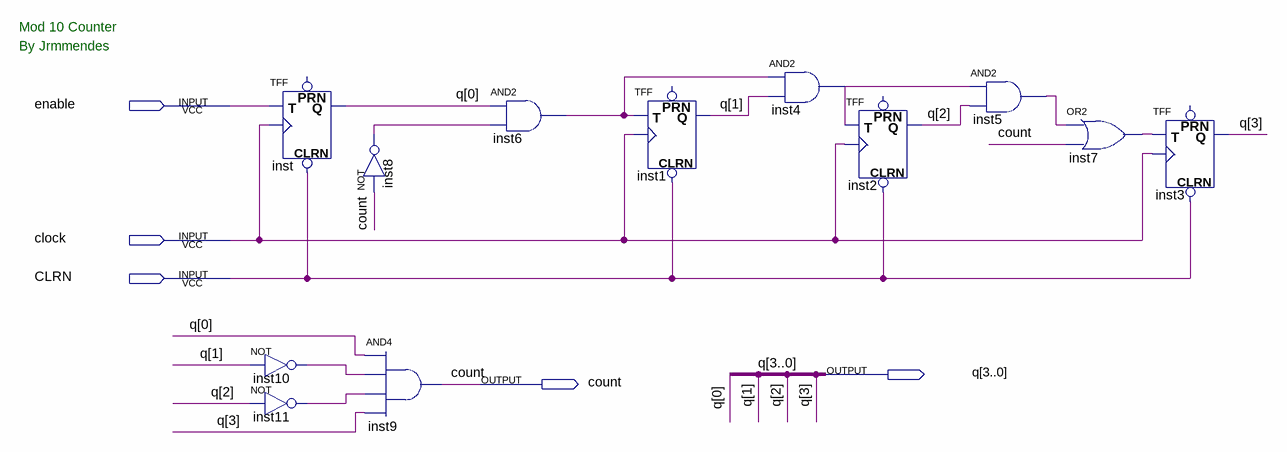
[diagram p0: schematic sheet]
// Quartus schematic mod_10_counter.bdf as structural Verilog: 12 symbols, 5 pins
module mod_10_counter (
  input  enable,
  input  clock,
  input  CLRN,
  output [3:0] q,
  output count
);

  wire inst4_out, inst5_out, inst6_out, inst7_out, inst8_out, inst10_out, inst11_out;

  TFF inst (.CLRN(CLRN), .T(enable), .CLK(clock), .Q(q[0]));  // open: PRN
  not inst10 (inst10_out, q[1]);
  not inst11 (inst11_out, q[2]);
  not inst8 (inst8_out, count);
  and inst9 (count, q[0], inst10_out, inst11_out, q[3]);
  and inst6 (inst6_out, q[0], inst8_out);
  TFF inst1 (.CLRN(CLRN), .T(inst6_out), .CLK(clock), .Q(q[1]));  // open: PRN
  and inst4 (inst4_out, inst6_out, q[1]);
  TFF inst2 (.CLRN(CLRN), .T(inst4_out), .CLK(clock), .Q(q[2]));  // open: PRN
  and inst5 (inst5_out, inst4_out, q[2]);
  or inst7 (inst7_out, inst5_out, count);
  TFF inst3 (.CLRN(CLRN), .T(inst7_out), .CLK(clock), .Q(q[3]));  // open: PRN

  // Notes on the sheet:
  //   Mod 10 Counter
  //   By Jrmmendes
endmodule
